# Altium schematic sheet [03] - MAIN BOARD.SchDoc
size A3; CompanyName: FPT-FTI copporation; Address1: FPT Building Duy Tan; Address2: Floor 4,; DocumentNumber: 3; SheetNumber: 3; SheetTotal: 5; NameAuthor: Angle Vu
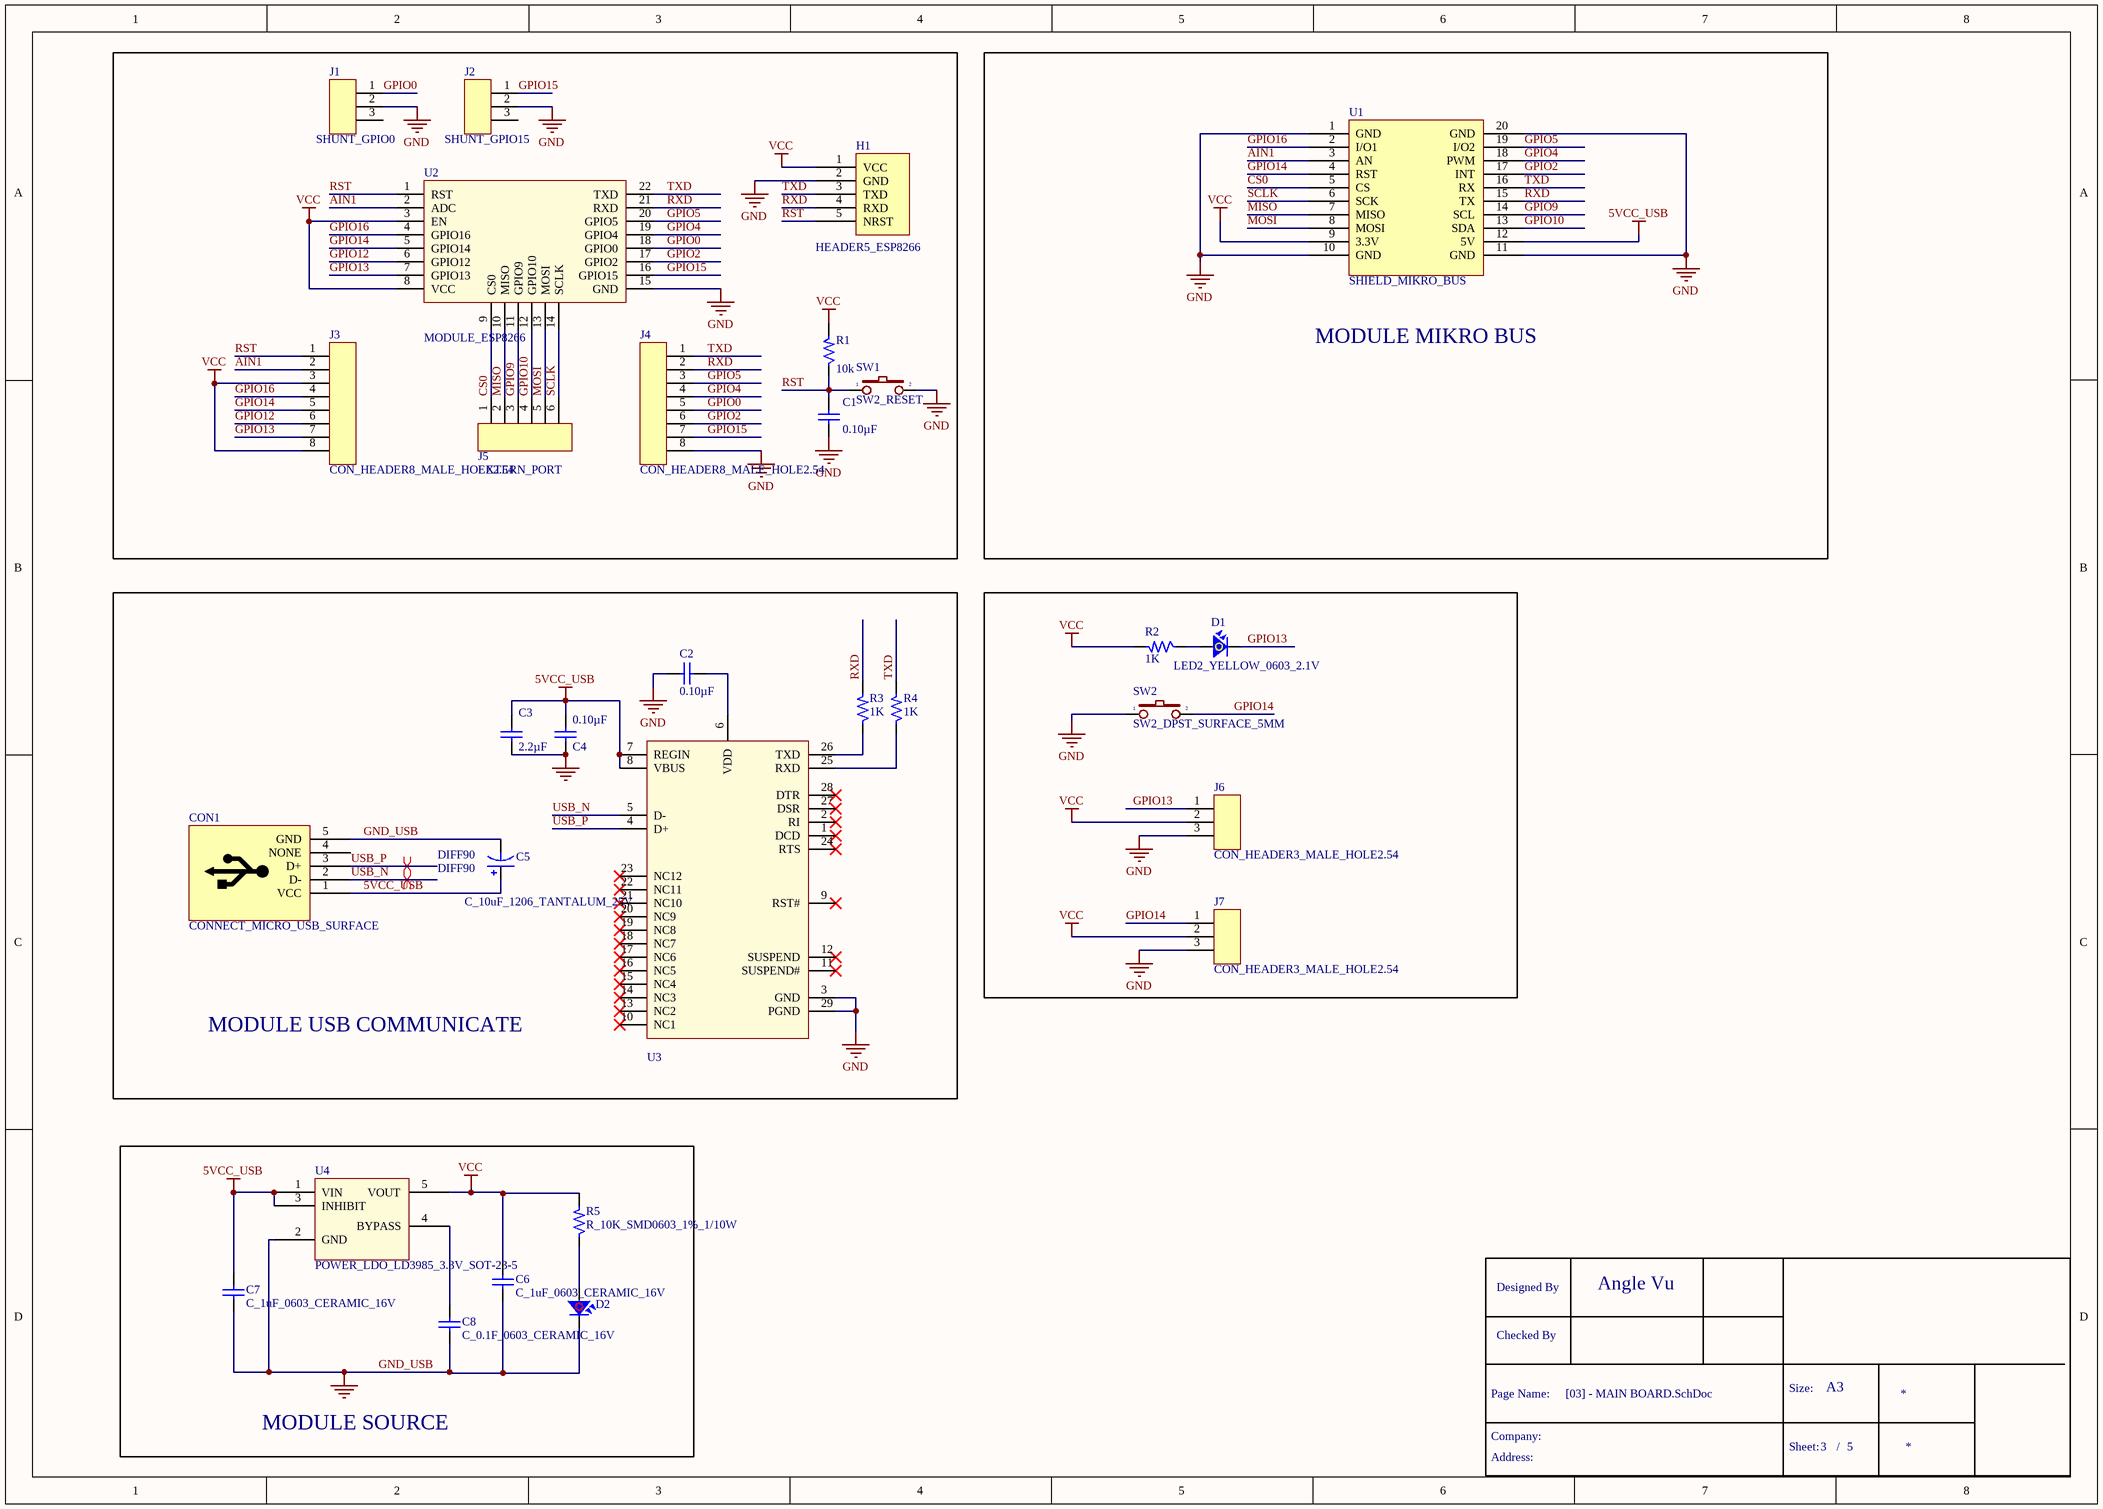
[diagram p0: [03] - MAIN BOARD.SchDoc]

## Parts
C1  Capacitance: 0.10µF  [CAP_SMD0603]  (hidden comment: C_0.1F_0603_CERAMIC_16V)
C2  Capacitance: 0.10µF  [CAP_SMD0603]  (hidden comment: C_0.1F_0603_CERAMIC_16V)
C3  Capacitance: 2.2µF  [CAP_SMD0603]  (hidden comment: C_2.2uF_0603_CERAMIC_16V)
C4  Capacitance: 0.10µF  [CAP_SMD0603]  (hidden comment: C_0.1F_0603_CERAMIC_16V)
C5  C_10uF_1206_TANTALUM_25V  [CAP_SMD1206_TANTALUM]
C6  C_1uF_0603_CERAMIC_16V  [CAP_SMD0603]
C7  C_1uF_0603_CERAMIC_16V  [CAP_SMD0603]
C8  C_0.1F_0603_CERAMIC_16V  [CAP_SMD0603]
CON1  CONNECT_MICRO_USB_SURFACE  [CON_MICRO_USB_HOLE]
D1  LED2_YELLOW_0603_2.1V  [LED_YELLOW_SMD0603]
D2  LED2_RED_0603_2V  [LED_RED_SMD0603]  (value not drawn)
H1  HEADER5_ESP8266  [HEADER5_ESP8266_HOLE_2.54]
J1  SHUNT_GPIO0  [CON_HEADER3_HOLE_2.54]
J2  SHUNT_GPIO15  [CON_HEADER3_HOLE_2.54]
J3  CON_HEADER8_MALE_HOLE2.54  [CON_HEADER8_HOLE_2.54]
J4  CON_HEADER8_MALE_HOLE2.54  [CON_HEADER8_HOLE_2.54]
J5  EXTERN_PORT  [CON_HEADER6_HOLE_2.54]
J6  CON_HEADER3_MALE_HOLE2.54  [CON_HEADER3_HOLE_2.54]
J7  CON_HEADER3_MALE_HOLE2.54  [CON_HEADER3_HOLE_2.54]
R1  Resistance (Ohms): 10k  [RES_SMD0603]  (hidden comment: R_10K_SMD0603_1%_1/10W)
R2  Resistance (Ohms): 1K  [RES_SMD0603]  (hidden comment: R_1K2_SMD0603_1%_1/10W)
R3  Resistance (Ohms): 1K  [RES_SMD0603]  (hidden comment: R_1K2_SMD0603_1%_1/10W)
R4  Resistance (Ohms): 1K  [RES_SMD0603]  (hidden comment: R_1K2_SMD0603_1%_1/10W)
R5  R_10K_SMD0603_1%_1/10W  [RES_SMD0603]
SW1  SW2_RESET  [SW2-SMD]
SW2  SW2_DPST_SURFACE_5MM  [SW2-SMD]
U1  SHIELD_MIKRO_BUS  [SHIELD_MIKRO_BUS]
U2  MODULE_ESP8266  [MODULE_ESP8266]
U3  USB_CP2102-GMR  [QFN_28PIN_USBC2102]  (value not drawn)
U4  POWER_LDO_LD3985_3.3V_SOT-23-5  [POWER_LDO_LDR3985-3.3]

## Blocks framed on the sheet
MODULE MIKRO BUS: U1
MODULE USB COMMUNICATE: C2-C5 CON1 R3 R4 U3
MODULE SOURCE: C6-C8 D2 R5 U4

## Nets
5VCC_USB: C3.2 C4.2 C5.1 C7.2 CON1.1(VCC) U1.12(5V) U3.7(REGIN) U3.8(VBUS) U4.1(VIN) U4.3(INHIBIT)
GND_USB: C1.1 C2.2 C3.1 C4.1 C5.2 C6.1 C7.1 C8.1 CON1.5(GND) D2.2 H1.2(GND) J1.2(SIGN-) J2.2(SIGN-) J4.8 J6.3 J7.3 SW1.2 SW2.1 U1.1(GND) U1.10(GND) U1.11(GND) U1.20(GND) U2.15(GND) U3.3(GND) U3.29(PGND) U4.2(GND)  [also labelled GND]
VCC: C6.2 H1.1(VCC) J3.3 J3.8 J6.2(SIGN-) J7.2(SIGN-) R1.2 R2.2 R5.2 U1.9(3.3V) U2.3(EN) U2.8(VCC) U4.5(VOUT)
AIN1: J3.2(SIGN-) U1.3(AN) U2.2(ADC)
CS0: J5.1(SIGN+) U1.5(CS) U2.9(CS0)
GPIO0: J1.1(SIGN+) J4.5 U2.18(GPIO0)
GPIO2: J4.6 U1.17(INT) U2.17(GPIO2)
GPIO4: J4.4 U1.18(PWM) U2.19(GPIO4)
GPIO5: J4.3 U1.19(I/O2) U2.20(GPIO5)
GPIO9: J5.3 U1.14(SCL) U2.11(GPIO9)
GPIO10: J5.4 U1.13(SDA) U2.12(GPIO10)
GPIO12: J3.6 U2.6(GPIO12)
GPIO13: D1.2 J3.7 J6.1(SIGN+) U2.7(GPIO13)
GPIO14: J3.5 J7.1(SIGN+) SW2.2 U1.4(RST) U2.5(GPIO14)
GPIO15: J2.1(SIGN+) J4.7 U2.16(GPIO15)
GPIO16: J3.4 U1.2(I/O1) U2.4(GPIO16)
MISO: J5.2(SIGN-) U1.7(MISO) U2.10(MISO)
MOSI: J5.5 U1.8(MOSI) U2.13(MOSI)
RST: C1.2 H1.5(NRST) J3.1(SIGN+) R1.1 SW1.1 U2.1(RST)
RXD: H1.4(RXD) J4.2(SIGN-) R3.2 U1.15(TX) U2.21(RXD)
SCLK: J5.6 U1.6(SCK) U2.14(SCLK)
TXD: H1.3(TXD) J4.1(SIGN+) R4.2 U1.16(RX) U2.22(TXD)
USB_N: CON1.2(D-) U3.5(D-)
USB_P: CON1.3(D+) U3.4(D+)
NetC2_1: C2.1 U3.6(VDD)
NetC8_2: C8.2 U4.4(BYPASS)
NetD1_1: D1.1 R2.1
NetD2_1: D2.1 R5.1
NetR3_1: R3.1 U3.26(TXD)
NetR4_1: R4.1 U3.25(RXD)

Not connected (* = marked no-connect by the designer): CON1 4(NONE); J1 3; J2 3; U3 1(DCD)* 2(RI)* 9(RST#)* 10(NC1)* 11(SUSPEND#)* 12(SUSPEND)* 13(NC2)* 14(NC3)* 15(NC4)* 16(NC5)* 17(NC6)* 18(NC7)* 19(NC8)* 20(NC9)* 21(NC10)* 22(NC11)* 23(NC12)* 24(RTS)* 27(DSR)* 28(DTR)*

## Layout directives
differential pair; net class DIFF90: USB_N, USB_P

## Notes on the sheet
- Designed By
- Page Name:
- Checked By
- Size:
- A3
- Company:
- Address:
- Sheet:
- /

## Library data of the parts
C1 C2 C4 = C_0.1F_0603_CERAMIC_16V: CAP CER 0.1UF 16V X7R 0603; Manufacturer: Murata Electronics North America; Manufacturer Part Number: GRM188R71C104KA01D; Tolerance: ±10%; Supplier 1: Digi-Key; RoHS: RoHS Compliant; Category: Capacitors; Stock 1: 3132000; Pricing 1: 4000=0.00359, 8000=0.00328, 12000=0.00312, 28000=0.00296, 100000=0.00215 (USD); Packaging: Tape & Reel (TR); Part Status: Active; Voltage - Rated: 16V; Temperature Coefficient: X7R; Mounting Type: Surface Mount, MLCC; Operating Temperature: -55°C ~ 125°C; Applications: General Purpose; Ratings: -; Package / Case: 0603 (1608 Metric); Size / Dimension: 0.063" L x 0.031" W (1.60mm x 0.80mm); Height - Seated (Max): -; Thickness (Max): 0.035" (0.90mm); Lead Spacing: -; Features: -; Lead Style: -; ComponentLink1URL: http://www.murata.com/~/media/webrenewal/support/library/catalog/products/capacitor/mlcc/c02e.pdf; ComponentLink1Description: http://www.murata.com/~/media/webrenewal/support/library/catalog/products/capacitor/mlcc/c02e.pdf; Supplier Part Number 1: 490-1532-2-ND
C3 = C_2.2uF_0603_CERAMIC_16V: CAP CER 2.2UF 16V X5R 0603; Manufacturer: Murata Electronics North America; Manufacturer Part Number: GRM188R61C225KE15D; Tolerance: ±10%; Supplier 1: Digi-Key; RoHS: RoHS Compliant; Category: Capacitors; Stock 1: 696000; Pricing 1: 4000=0.0172, 8000=0.016, 12000=0.0152, 28000=0.0144, 100000=0.0109 (USD); Packaging: Tape & Reel (TR); Part Status: Active; Voltage - Rated: 16V; Temperature Coefficient: X5R; Operating Temperature: -55°C ~ 85°C; Features: -; Ratings: -; Applications: General Purpose; Failure Rate: *; Mounting Type: Surface Mount, MLCC; Package / Case: 0603 (1608 Metric); Size / Dimension: 0.063" L x 0.031" W (1.60mm x 0.80mm); Height - Seated (Max): -; Thickness (Max): 0.035" (0.90mm); Lead Spacing: -; Lead Style: -; ComponentLink1URL: http://www.murata.com/~/media/webrenewal/support/library/catalog/products/capacitor/mlcc/c02e.pdf; ComponentLink1Description: http://www.murata.com/~/media/webrenewal/support/library/catalog/products/capacitor/mlcc/c02e.pdf; Supplier Part Number 1: 490-3296-2-ND
C5 = C_10uF_1206_TANTALUM_25V: CAP TANT 10UF 25V 10% 1206; Manufacturer: AVX Corporation; Manufacturer Part Number: F951E106KAAAQ2; Manufacturer Size Code: A; Capacitance: 10µF; ESR (Equivalent Series Resistance): 2 Ohm; Type: Conformal Coated; Supplier 1: Digi-Key; RoHS: RoHS Compliant; Category: Capacitors; Stock 1: 2500; Pricing 1: 2500=0.31132, 5000=0.29521, 12500=0.27975, 25000=0.27374, 62500=0.27009, 125000=0.26043 (USD); Packaging: Tape & Reel (TR); Part Status: Active; Tolerance: ±10%; Voltage - Rated: 25V; Operating Temperature: -55°C ~ 125°C; Mounting Type: Surface Mount; Package / Case: 1206 (3216 Metric); Size / Dimension: 0.126" L x 0.067" W (3.20mm x 1.70mm); Height - Seated (Max): 0.063" (1.60mm); Lead Spacing: -; Features: General Purpose; Lifetime @ Temp.: -; ComponentLink1URL: http://datasheets.avx.com/f95.pdf; ComponentLink1Description: http://datasheets.avx.com/f95.pdf; Supplier Part Number 1: 478-8494-2-ND
C6 C7 = C_1uF_0603_CERAMIC_16V: CAP CER 1UF 16V X5R 0603; Manufacturer: Murata Electronics North America; Manufacturer Part Number: GRM188R61C105KA93D; Capacitance: 1µF; Tolerance: ±10%; Supplier 1: Digi-Key; RoHS: RoHS Compliant; Category: Capacitors; Stock 1: 708000; Pricing 1: 4000=0.00644, 8000=0.00588, 12000=0.0056, 28000=0.00532, 100000=0.00385 (USD); Packaging: Tape & Reel (TR); Part Status: Active; Voltage - Rated: 16V; Temperature Coefficient: X5R; Mounting Type: Surface Mount, MLCC; Operating Temperature: -55°C ~ 85°C; Applications: General Purpose; Ratings: -; Package / Case: 0603 (1608 Metric); Size / Dimension: 0.063" L x 0.031" W (1.60mm x 0.80mm); Height - Seated (Max): -; Thickness (Max): 0.035" (0.90mm); Lead Spacing: -; Features: -; Lead Style: -; ComponentLink1URL: http://www.murata.com/~/media/webrenewal/support/library/catalog/products/capacitor/mlcc/c02e.pdf; ComponentLink1Description: http://www.murata.com/~/media/webrenewal/support/library/catalog/products/capacitor/mlcc/c02e.pdf; Supplier Part Number 1: 490-1536-2-ND
C8 = C_0.1F_0603_CERAMIC_16V: CAP CER 0.1UF 16V X7R 0603; Manufacturer: Murata Electronics North America; Manufacturer Part Number: GRM188R71C104KA01D; Capacitance: 0.10µF; Tolerance: ±10%; Supplier 1: Digi-Key; RoHS: RoHS Compliant; Category: Capacitors; Stock 1: 3132000; Pricing 1: 4000=0.00359, 8000=0.00328, 12000=0.00312, 28000=0.00296, 100000=0.00215 (USD); Packaging: Tape & Reel (TR); Part Status: Active; Voltage - Rated: 16V; Temperature Coefficient: X7R; Mounting Type: Surface Mount, MLCC; Operating Temperature: -55°C ~ 125°C; Applications: General Purpose; Ratings: -; Package / Case: 0603 (1608 Metric); Size / Dimension: 0.063" L x 0.031" W (1.60mm x 0.80mm); Height - Seated (Max): -; Thickness (Max): 0.035" (0.90mm); Lead Spacing: -; Features: -; Lead Style: -; ComponentLink1URL: http://www.murata.com/~/media/webrenewal/support/library/catalog/products/capacitor/mlcc/c02e.pdf; ComponentLink1Description: http://www.murata.com/~/media/webrenewal/support/library/catalog/products/capacitor/mlcc/c02e.pdf; Supplier Part Number 1: 490-1532-2-ND
CON1 = CONNECT_MICRO_USB_SURFACE: CONN RCPT STD MICRO USB TYPE B; Manufacturer: Amphenol FCI; Manufacturer Part Number: 10103593-0001LF; Connector Type: USB - micro B; Number of Contacts: 5; Gender: Receptacle; Specifications: USB 2.0; Regulator Topology: Positive Fixed; Voltage - Output: 3.3V; Current - Output: 150mA; Voltage - Dropout (Typical): 0.06V @ 150mA; Number of Regulators: 1; Voltage - Input: Up to 6V; Current - Limit (Min): 300mA; RoHS: RoHS Compliant; Category: Connectors, Interconnects; Packaging: Digi-Reel®; Part Status: Active; Mounting Type: Board Cutout, Surface Mount, Right Angle; Features: Shielded, Solder Retention; Ingress Protection: -; ComponentLink1URL: http://portal.fciconnect.com/Comergent//fci/drawing/10103593.pdf; ComponentLink1Description: http://portal.fciconnect.com/Comergent//fci/drawing/10103593.pdf; Operating Temperature: -40°C ~ 125°C; Package / Case: SC-74A, SOT-753; Supplier Device Package: SOT-23-5; ComponentLink2URL: http://www.st.com/web/en/resource/technical/document/datasheet/CD00003395.pdf; ComponentLink2Description: http://www.st.com/web/en/resource/technical/document/datasheet/CD00003395.pdf; Supplier 1: Digi-Key; Stock 1: 4000; Pricing 1: 1000=0.36878, 2000=0.3576, 3000=0.33525, 5000=0.32408, 10000=0.30173, 25000=0.29055 (USD); Supplier Part Number 1: 609-4049-2-ND
D1 = LED2_YELLOW_0603_2.1V: LED YELLOW CLEAR 0603 SMD; Manufacturer: Lite-On Inc.; Manufacturer Part Number: LTST-C191KSKT; Lens Color: Colorless; Millicandela Rating: 104mcd; Lens Style/Size: Rectangle with Flat Top, 1.10mm x 0.80mm; Voltage - Forward (Vf) (Typ): 2.1V; Current - Test: 20mA; Viewing Angle: 130°; Wavelength - Dominant: 591nm; Wavelength - Peak: 588nm; Supplier 1: Digi-Key; RoHS: RoHS Compliant; Category: Optoelectronics; Stock 1: 280000; Pricing 1: 5000=0.043, 10000=0.0387, 25000=0.0344, 50000=0.03118, 125000=0.02903 (USD); Packaging: Tape & Reel (TR); Part Status: Active; Color: Yellow; Lens Transparency: Clear; Mounting Type: Surface Mount; Features: -; Package / Case: 0603 (1608 Metric); Supplier Device Package: *; Size / Dimension: 1.60mm L x 0.80mm W; Height (Max): 0.55mm; ComponentLink1URL: http://optoelectronics.liteon.com/upload/download/DS22-2000-224/S_110_LTST-C191KSKT.pdf; ComponentLink1Description: http://optoelectronics.liteon.com/upload/download/DS22-2000-224/S_110_LTST-C191KSKT.pdf; Supplier Part Number 1: 160-1448-2-ND
D2 = LED2_RED_0603_2V: LED RED CLEAR 0603 SMD; Manufacturer: Lite-On Inc.; Manufacturer Part Number: LTST-C191KRKT; Lens Color: Colorless; Millicandela Rating: 54mcd; Lens Style/Size: Rectangle with Flat Top, 1.10mm x 0.80mm; Voltage - Forward (Vf) (Typ): 2V; Current - Test: 20mA; Viewing Angle: 130°; Wavelength - Dominant: 631nm; Wavelength - Peak: 639nm; Supplier 1: Digi-Key; RoHS: RoHS Compliant; Category: Optoelectronics; Stock 1: 680000; Pricing 1: 5000=0.0404, 10000=0.03636, 25000=0.03232, 50000=0.02929, 125000=0.02727 (USD); Packaging: Tape & Reel (TR); Part Status: Active; Color: Red; Lens Transparency: Clear; Mounting Type: Surface Mount; Features: -; Package / Case: 0603 (1608 Metric); Supplier Device Package: *; Size / Dimension: 1.60mm L x 0.80mm W; Height (Max): 0.55mm; ComponentLink1URL: http://optoelectronics.liteon.com/upload/download/DS22-2000-223/S_110_LTST-C191KRKT.pdf; ComponentLink1Description: http://optoelectronics.liteon.com/upload/download/DS22-2000-223/S_110_LTST-C191KRKT.pdf; Supplier Part Number 1: 160-1447-2-ND
H1 = HEADER5_ESP8266_HOLE_2.54: CONN HEADER 5 POS 2.54; Manufacturer: Wurth Electronics Inc; Manufacturer Part Number: 61300511121; Connector Type: Header, Unshrouded; Number of Positions: 5; Number of Positions Loaded: All; Pitch: 0.100" (2.54mm); Supplier 1: Digi-Key; RoHS: RoHS Compliant; Category: Connectors, Interconnects; Stock 1: 5098; Pricing 1: 1=0.23, 100=0.2106, 500=0.1782 (USD); Packaging: Bulk; Part Status: Active; Contact Type: Male Pin; Number of Rows: 1; Row Spacing: -; Contact Mating Length: 0.236" (6.00mm); Mounting Type: Through Hole; Termination: Solder; Fastening Type: -; Features: -; Contact Finish: Gold; Contact Finish Thickness: -; Color: Black; ComponentLink1URL: http://katalog.we-online.de/em/datasheet/6130xx11121.pdf; ComponentLink1Description: http://katalog.we-online.de/em/datasheet/6130xx11121.pdf; Supplier Part Number 1: 732-5318-ND
J1 J2 J6 J7 = CON_HEADER3_MALE_HOLE2.54: CON_HEADER10_HOLE2.54; Manufacturer: 3M; Manufacturer Part Number: 961102-6404-AR; Connector Type: Header, Unshrouded; Number of Positions: 2; Number of Positions Loaded: All; Pitch: 0.100" (2.54mm); RoHS: RoHS Compliant; Category: Connectors, Interconnects; Packaging: Bulk; Part Status: Active; Contact Type: Male Pin; Number of Rows: 1; Row Spacing: -; Contact Mating Length: 0.217" (5.50mm); Mounting Type: Through Hole; Termination: Solder; Fastening Type: -; Features: -; Contact Finish: Gold; Contact Finish Thickness: Flash; Color: Black; ComponentLink1URL: http://multimedia.3m.com/mws/media/548112O/3mtm-pin-strip-header-ts2181.pdf; ComponentLink1Description: http://multimedia.3m.com/mws/media/548112O/3mtm-pin-strip-header-ts2181.pdf; Supplier 1: Digi-Key; Stock 1: 37227; Pricing 1: 1=0.74, 10=0.658, 100=0.5418, 500=0.42828, 1000=0.36765, 5000=0.3354, 10000=0.3225 (USD); ComponentLink2URL: http://media.digikey.com/PDF/Data%20Sheets/Sullins%20PDFs/xRxCzzzSxxN-RC_ST_11635-B.pdf; ComponentLink2Description: http://media.digikey.com/PDF/Data%20Sheets/Sullins%20PDFs/xRxCzzzSxxN-RC_ST_11635-B.pdf; Supplier Part Number 1: S1011EC-40-ND
J3 J4 = CON_HEADER8_MALE_HOLE2.54: CON_HEADER10_HOLE2.54; Manufacturer: 3M; Manufacturer Part Number: 961102-6404-AR; Connector Type: Header, Unshrouded; Number of Positions: 2; Number of Positions Loaded: All; Pitch: 0.100" (2.54mm); RoHS: RoHS Compliant; Category: Connectors, Interconnects; Packaging: Bulk; Part Status: Active; Contact Type: Male Pin; Number of Rows: 1; Row Spacing: -; Contact Mating Length: 0.217" (5.50mm); Mounting Type: Through Hole; Termination: Solder; Fastening Type: -; Features: -; Contact Finish: Gold; Contact Finish Thickness: Flash; Color: Black; ComponentLink1URL: http://multimedia.3m.com/mws/media/548112O/3mtm-pin-strip-header-ts2181.pdf; ComponentLink1Description: http://multimedia.3m.com/mws/media/548112O/3mtm-pin-strip-header-ts2181.pdf; Supplier 1: Digi-Key; Stock 1: 37227; Pricing 1: 1=0.74, 10=0.658, 100=0.5418, 500=0.42828, 1000=0.36765, 5000=0.3354, 10000=0.3225 (USD); ComponentLink2URL: http://media.digikey.com/PDF/Data%20Sheets/Sullins%20PDFs/xRxCzzzSxxN-RC_ST_11635-B.pdf; ComponentLink2Description: http://media.digikey.com/PDF/Data%20Sheets/Sullins%20PDFs/xRxCzzzSxxN-RC_ST_11635-B.pdf; Supplier Part Number 1: S1011EC-40-ND
J5 = CON_HEADER6_MALE_HOLE2.54: CON_HEADER10_HOLE2.54; Manufacturer: 3M; Manufacturer Part Number: 961102-6404-AR; Connector Type: Header, Unshrouded; Number of Positions: 2; Number of Positions Loaded: All; Pitch: 0.100" (2.54mm); RoHS: RoHS Compliant; Category: Connectors, Interconnects; Packaging: Bulk; Part Status: Active; Contact Type: Male Pin; Number of Rows: 1; Row Spacing: -; Contact Mating Length: 0.217" (5.50mm); Mounting Type: Through Hole; Termination: Solder; Fastening Type: -; Features: -; Contact Finish: Gold; Contact Finish Thickness: Flash; Color: Black; ComponentLink1URL: http://multimedia.3m.com/mws/media/548112O/3mtm-pin-strip-header-ts2181.pdf; ComponentLink1Description: http://multimedia.3m.com/mws/media/548112O/3mtm-pin-strip-header-ts2181.pdf; Supplier 1: Digi-Key; Stock 1: 37227; Pricing 1: 1=0.74, 10=0.658, 100=0.5418, 500=0.42828, 1000=0.36765, 5000=0.3354, 10000=0.3225 (USD); ComponentLink2URL: http://media.digikey.com/PDF/Data%20Sheets/Sullins%20PDFs/xRxCzzzSxxN-RC_ST_11635-B.pdf; ComponentLink2Description: http://media.digikey.com/PDF/Data%20Sheets/Sullins%20PDFs/xRxCzzzSxxN-RC_ST_11635-B.pdf; Supplier Part Number 1: S1011EC-40-ND
R1 R5 = R_10K_SMD0603_1%_1/10W: RES SMD 10K OHM 1% 1/10W 0603; Manufacturer: Yageo; Manufacturer Part Number: RC0603FR-0710KL; Power (Watts): 0.1W, 1/10W; Temperature Coefficient: ±100ppm/°C; Capacitance: 0.10µF; Voltage - Rated: 50V; Supplier 1: Digi-Key; RoHS: RoHS Compliant; Category: Resistors; Stock 1: 10005000; Pricing 1: 5000=0.00167, 10000=0.00145, 25000=0.00128, 50000=0.00117, 125000=0.00115 (USD); Packaging: Tape & Reel (TR); Part Status: Active; Tolerance: ±1%; Composition: Thick Film; Features: Moisture Resistant; Operating Temperature: -55°C ~ 155°C; Package / Case: 0603 (1608 Metric); Supplier Device Package: 0603; Size / Dimension: 0.063" L x 0.031" W (1.60mm x 0.80mm); Height: 0.022" (0.55mm); Number of Terminations: 2; ComponentLink1URL: http://www.yageo.com/documents/recent/PYu-RC_Group_51_RoHS_L_04.pdf; ComponentLink1Description: http://www.yageo.com/documents/recent/PYu-RC_Group_51_RoHS_L_04.pdf; Supplier Part Number 1: 311-10.0KHRTR-ND; Mounting Type: Surface Mount, MLCC; Applications: General Purpose; Ratings: -; Height - Seated (Max): -; Thickness (Max): 0.037" (0.94mm); Lead Spacing: -; Lead Style: -; ComponentLink2URL: http://datasheets.avx.com/X7RDielectric.pdf; ComponentLink2Description: http://datasheets.avx.com/X7RDielectric.pdf
  R5: Resistance (Ohms): 10k
R2-R4 = R_1K2_SMD0603_1%_1/10W: RES SMD 1.2K OHM 1% 1/10W 0603; Manufacturer: Yageo; Manufacturer Part Number: RC0603FR-071K2L; Power (Watts): 0.1W, 1/10W; Temperature Coefficient: ±100ppm/°C; Supplier 1: Digi-Key; RoHS: RoHS Compliant; Category: Resistors; Stock 1: 560000; Pricing 1: 5000=0.00167, 10000=0.00145, 25000=0.00128, 50000=0.00117, 125000=0.00115 (USD); Packaging: Tape & Reel (TR); Part Status: Active; Tolerance: ±1%; Composition: Thick Film; Features: Moisture Resistant; Operating Temperature: -55°C ~ 155°C; Package / Case: 0603 (1608 Metric); Supplier Device Package: 0603; Size / Dimension: 0.063" L x 0.031" W (1.60mm x 0.80mm); Height: 0.022" (0.55mm); Number of Terminations: 2; ComponentLink1URL: http://www.yageo.com/documents/recent/PYu-RC_Group_51_RoHS_L_04.pdf; ComponentLink1Description: http://www.yageo.com/documents/recent/PYu-RC_Group_51_RoHS_L_04.pdf; Supplier Part Number 1: 311-1.20KHRTR-ND
SW1 SW2 = SW2_DPST_SURFACE_5MM: SWITCH TACTILE SPST-NO 0.05A 12V; Manufacturer: Wurth Electronics Inc; Manufacturer Part Number: 434121050836; Switch Function: Off-Mom; Contact Rating @ Voltage: 0.05A @ 12VDC; Actuator Type: Rectangular Button; Actuator Height off PCB, from Pins: 5.00mm; Actuator Orientation: Top Actuated; Outline: 6.00mm x 3.50mm; Illumination: Non-Illuminated; Operating Force: 360gf; Actuator Material: Liquid Crystal Polymer (LCP); Switch Travel: 0.25mm; Mechanical Life: 50,000 Cycles; Supplier 1: Digi-Key; RoHS: RoHS Compliant; Category: Switches; Stock 1: 0; Pricing 1: 1500=0.27 (USD); Packaging: Tape & Reel (TR); Part Status: Active; Circuit: SPST-NO; Mounting Type: Surface Mount; Termination Style: SMD (SMT) Tab; Illumination Voltage (Nominal): -; Illumination Type, Color: -; Ingress Protection: -; Features: -; Operating Temperature: -40°C ~ 85°C; ComponentLink1URL: http://katalog.we-online.de/em/datasheet/434121050836.pdf; ComponentLink1Description: http://katalog.we-online.de/em/datasheet/434121050836.pdf; Supplier Part Number 1: 732-7049-2-ND
U3 = USB_CP2102-GMR: IC USB-TO-UART BRIDGE 28VQFN; Manufacturer: Silicon Labs; Protocol: USB; Function: Bridge, USB to UART; Interface: UART; Standards: USB 2.0; Voltage - Supply: 3 V ~ 3.6 V; Current - Supply: 20mA; Supplier 1: Digi-Key; Manufacturer Part Number: CP2102-GMR; RoHS: RoHS Compliant; Category: Integrated Circuits (ICs); Stock 1: 6000; Pricing 1: 1500=2.35039 (USD); Packaging: Tape & Reel (TR); Part Status: Active; Operating Temperature: -40°C ~ 85°C; Package / Case: 28-VFQFN Exposed Pad; Supplier Device Package: 28-QFN (5x5); ComponentLink1URL: http://www.silabs.com/Support%20Documents/TechnicalDocs/CP2102-9.pdf; ComponentLink1Description: http://www.silabs.com/Support%20Documents/TechnicalDocs/CP2102-9.pdf; Supplier Part Number 1: 336-1160-2-ND
U4 = POWER_LDO_LD3985_3.3V_SOT-23-5: IC REG LDO 3.3V 0.15A SOT23-5; Manufacturer: STMicroelectronics; Manufacturer Part Number: LD3985M33R; Regulator Topology: Positive Fixed; Current - Output: 150mA; Voltage - Dropout (Typical): 0.06V @ 150mA; Number of Regulators: 1; Voltage - Input: Up to 6V; Current - Limit (Min): 300mA; Resistance (Ohms): 100k; Tolerance: ±0.1%; Power (Watts): 1W; Temperature Coefficient: ±50ppm/°C; Supplier 1: Digi-Key; RoHS: RoHS Compliant; Category: Integrated Circuits (ICs); Stock 1: 6000; Pricing 1: 3000=0.2294, 6000=0.2146, 15000=0.1998, 30000=0.18944, 75000=0.185, 150000=0.1776 (USD); Packaging: Tape & Reel (TR); Part Status: Active; Voltage - Output: 3.3V; Operating Temperature: -40°C ~ 125°C; Mounting Type: Surface Mount; Package / Case: SC-74A, SOT-753; Supplier Device Package: SOT-23-5; ComponentLink1URL: http://www.st.com/web/en/resource/technical/document/datasheet/CD00003395.pdf; ComponentLink1Description: http://www.st.com/web/en/resource/technical/document/datasheet/CD00003395.pdf; Supplier Part Number 1: 497-3504-2-ND; Composition: Metal Film; Features: Flame Proof, Moisture Resistant, Safety; Size / Dimension: 0.090" Dia x 0.240" L (2.29mm x 6.10mm); Height: -; Number of Terminations: 2; Failure Rate: -; ComponentLink2URL: http://www.vishay.com/docs/31021/cpf.pdf; ComponentLink2Description: http://www.vishay.com/docs/31021/cpf.pdf